# Altium schematic sheet Page02 BLOCK DIAGRAM.SchDoc
size 513 x 386 mm
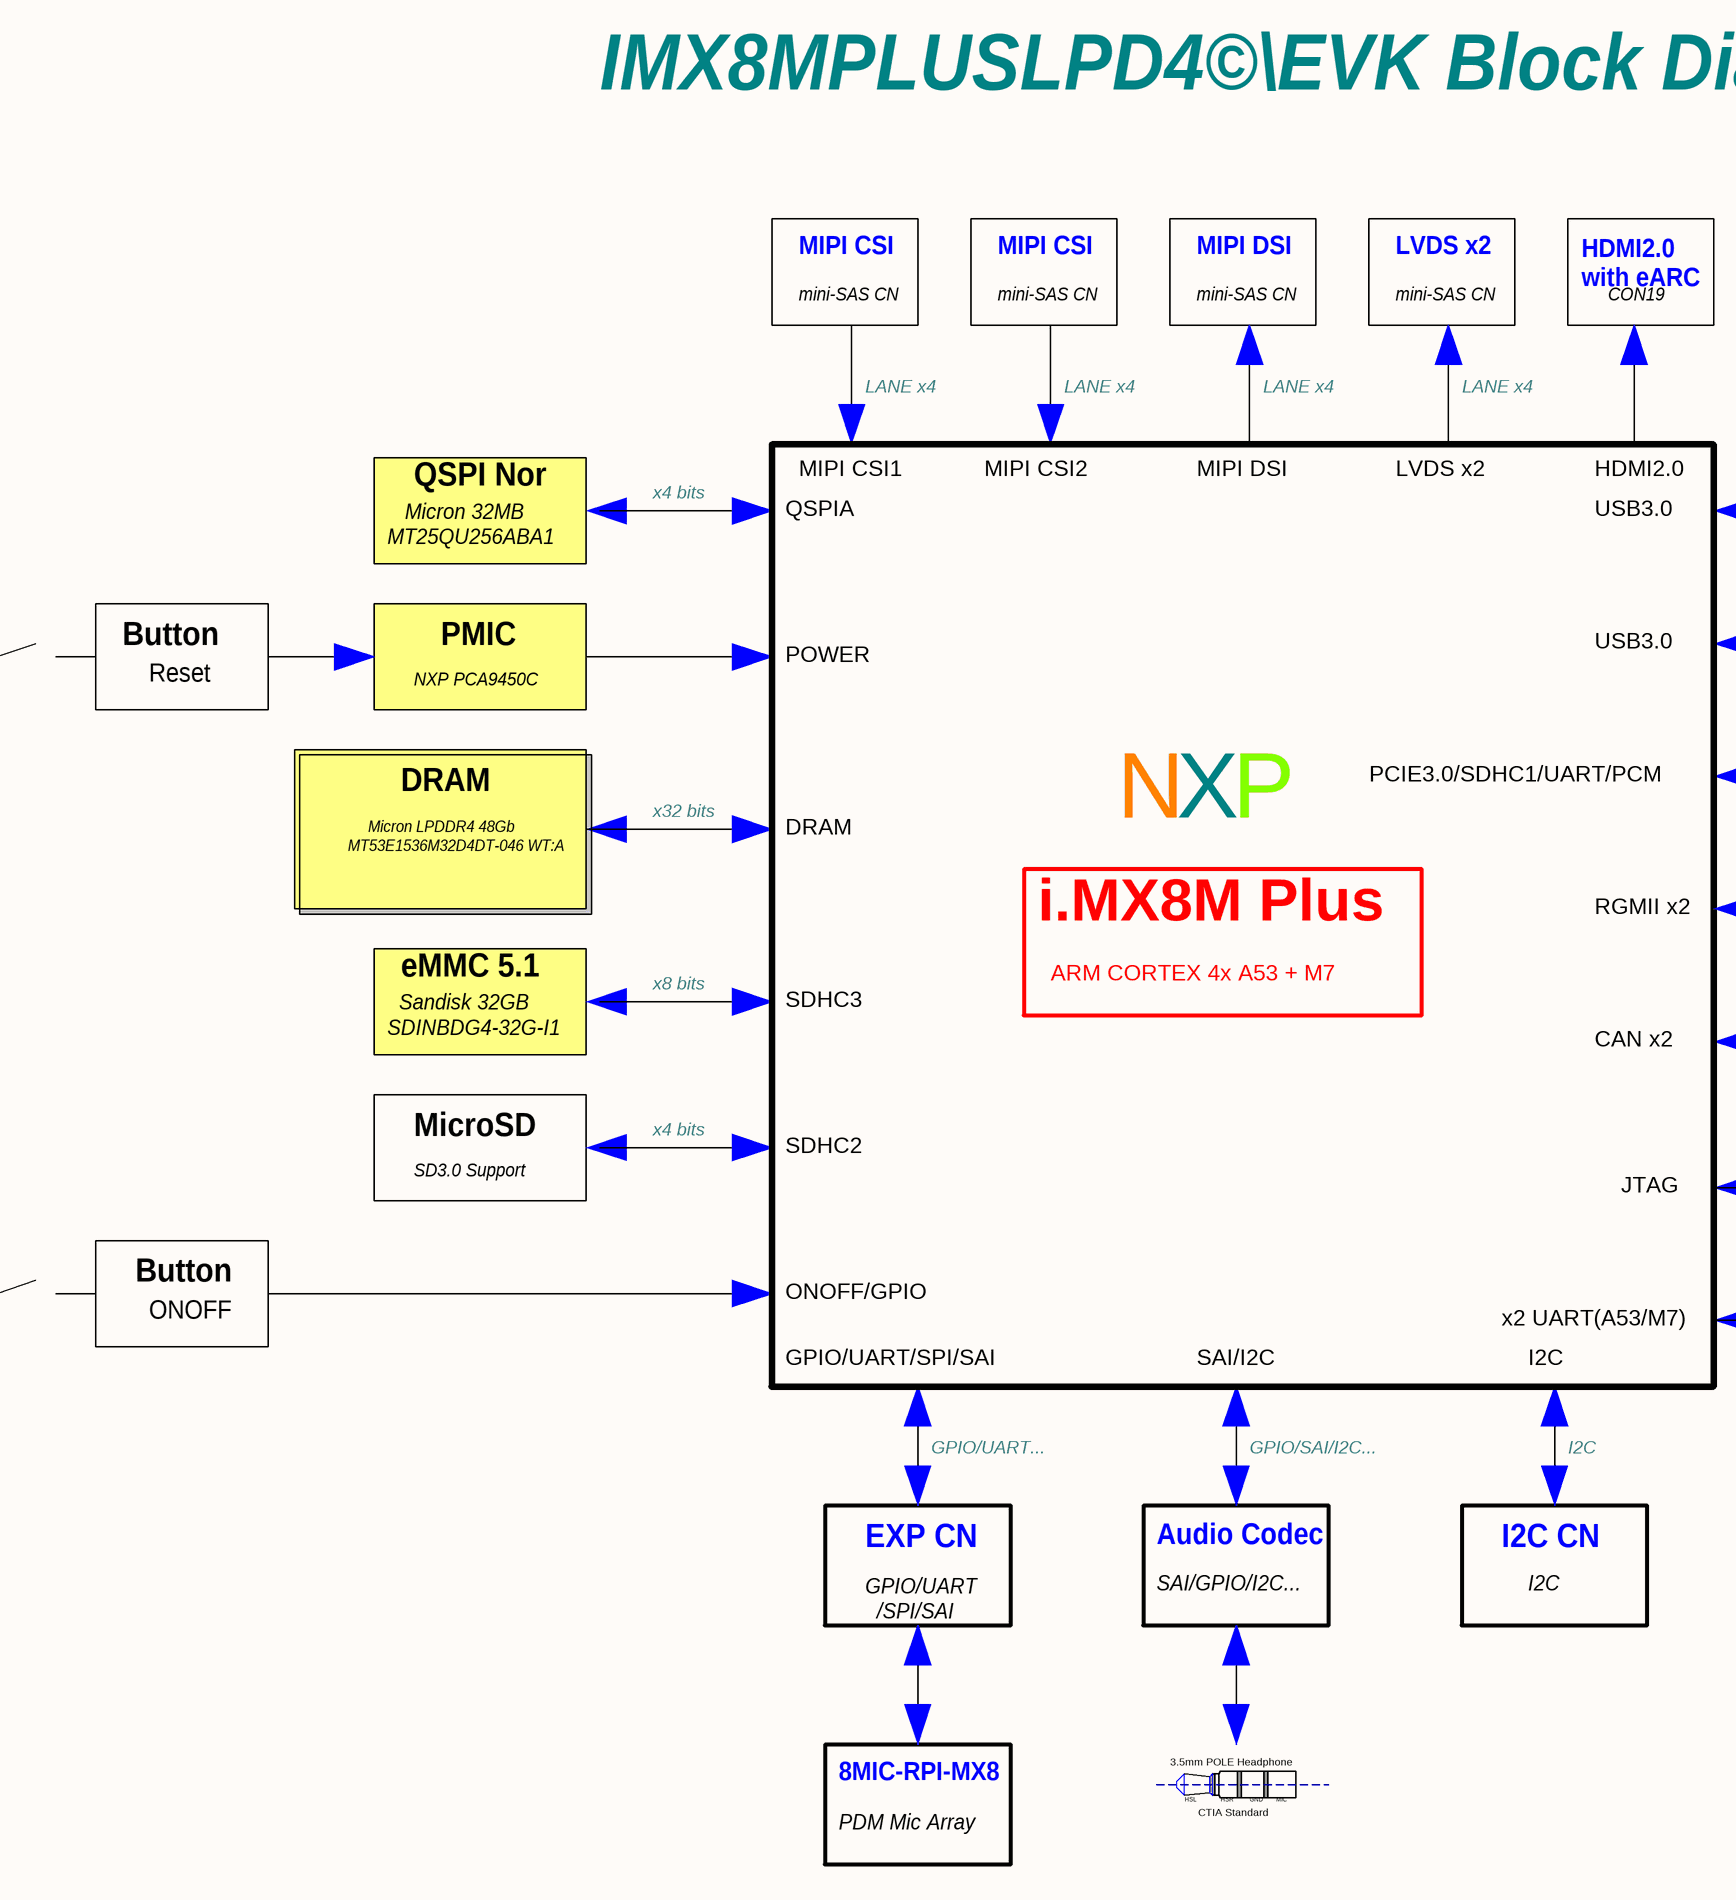
[diagram p0: Page02 BLOCK DIAGRAM.SchDoc, left]
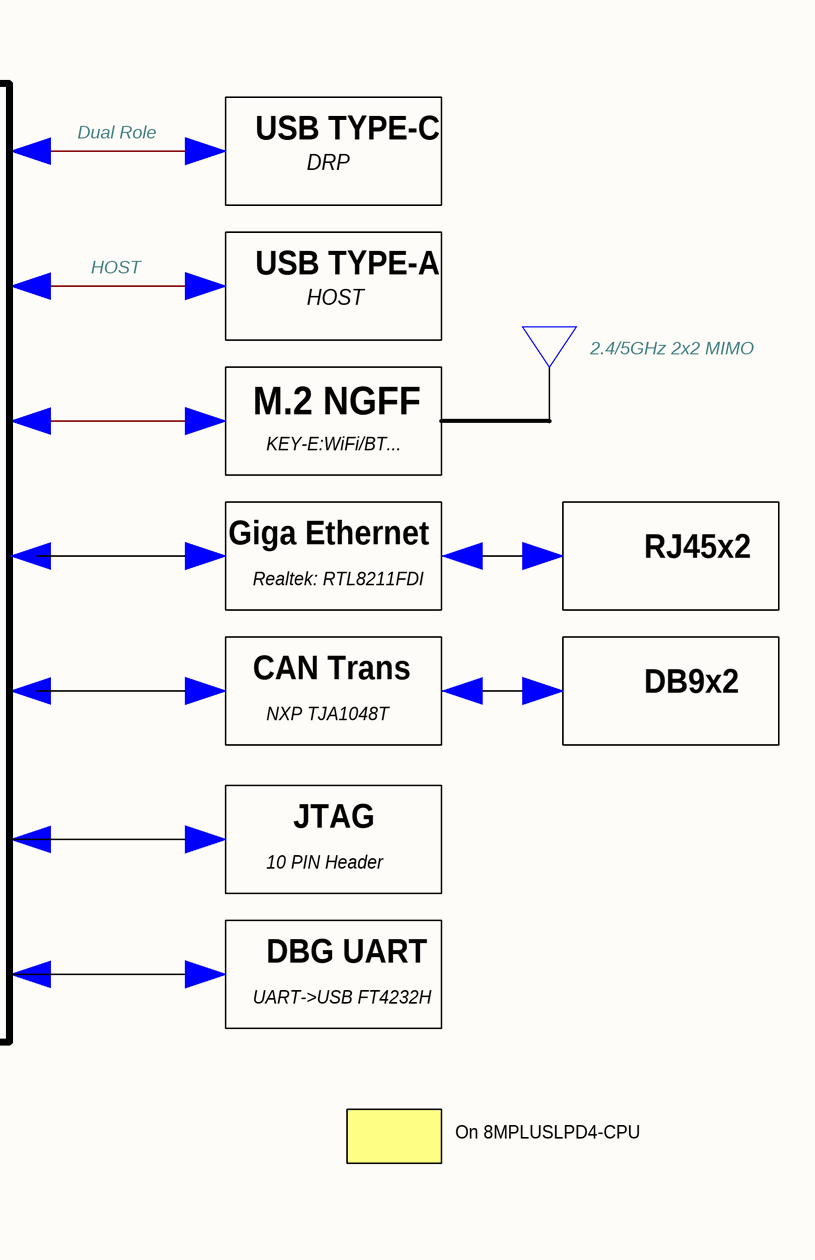
[diagram p1: Page02 BLOCK DIAGRAM.SchDoc, right]

## Notes on the sheet
- IMX8MPLUSLPD4©\EVK Block Diagram
- MIPI CSI
- MIPI DSI
- LVDS x2
- HDMI2.0
  with eARC
- mini-SAS CN
- CON19
- LANE x4
- Micron 32MB
  MT25QU256ABA1
- QSPI Nor
- x4 bits
- QSPIA
- MIPI CSI1
- MIPI CSI2
- HDMI2.0
- USB3.0
- Dual Role
- USB TYPE-C
- DRP
- Button
- Reset
- PMIC
- POWER
- HOST
- USB TYPE-A
- NXP PCA9450C
- 2.4/5GHz 2x2 MIMO
- DRAM
- PCIE3.0/SDHC1/UART/PCM
- M.2 NGFF
- Micron LPDDR4 48Gb
  MT53E1536M32D4DT-046 WT:A
- x32 bits
- N
- X
- P
- KEY-E:WiFi/BT...
- i.MX8M Plus
- RGMII x2
- Giga Ethernet
- RJ45x2
- Sandisk 32GB
  SDINBDG4-32G-I1
- eMMC 5.1
- x8 bits
- ARM CORTEX 4x A53 + M7
- Realtek: RTL8211FDI
- SDHC3
- CAN x2
- CAN Trans
- DB9x2
- NXP TJA1048T
- MicroSD
- SD3.0 Support
- SDHC2
- JTAG
- 10 PIN Header
- ONOFF
- ONOFF/GPIO
- x2 UART(A53/M7)
- DBG UART
- GPIO/UART/SPI/SAI
- SAI/I2C
- I2C
- UART->USB FT4232H
- GPIO/UART...
- GPIO/SAI/I2C...
- On 8MPLUSLPD4-CPU
- EXP CN
- GPIO/UART
  /SPI/SAI
- SAI/GPIO/I2C...
- Audio Codec
- I2C CN
- 8MIC-RPI-MX8
- 3.5mm POLE Headphone
- PDM Mic Array
- HSL
- CTIA Standard
- HSR
- GND
- MIC